# EAGLE schematic MainBoard (EAGLE 9.1.3)
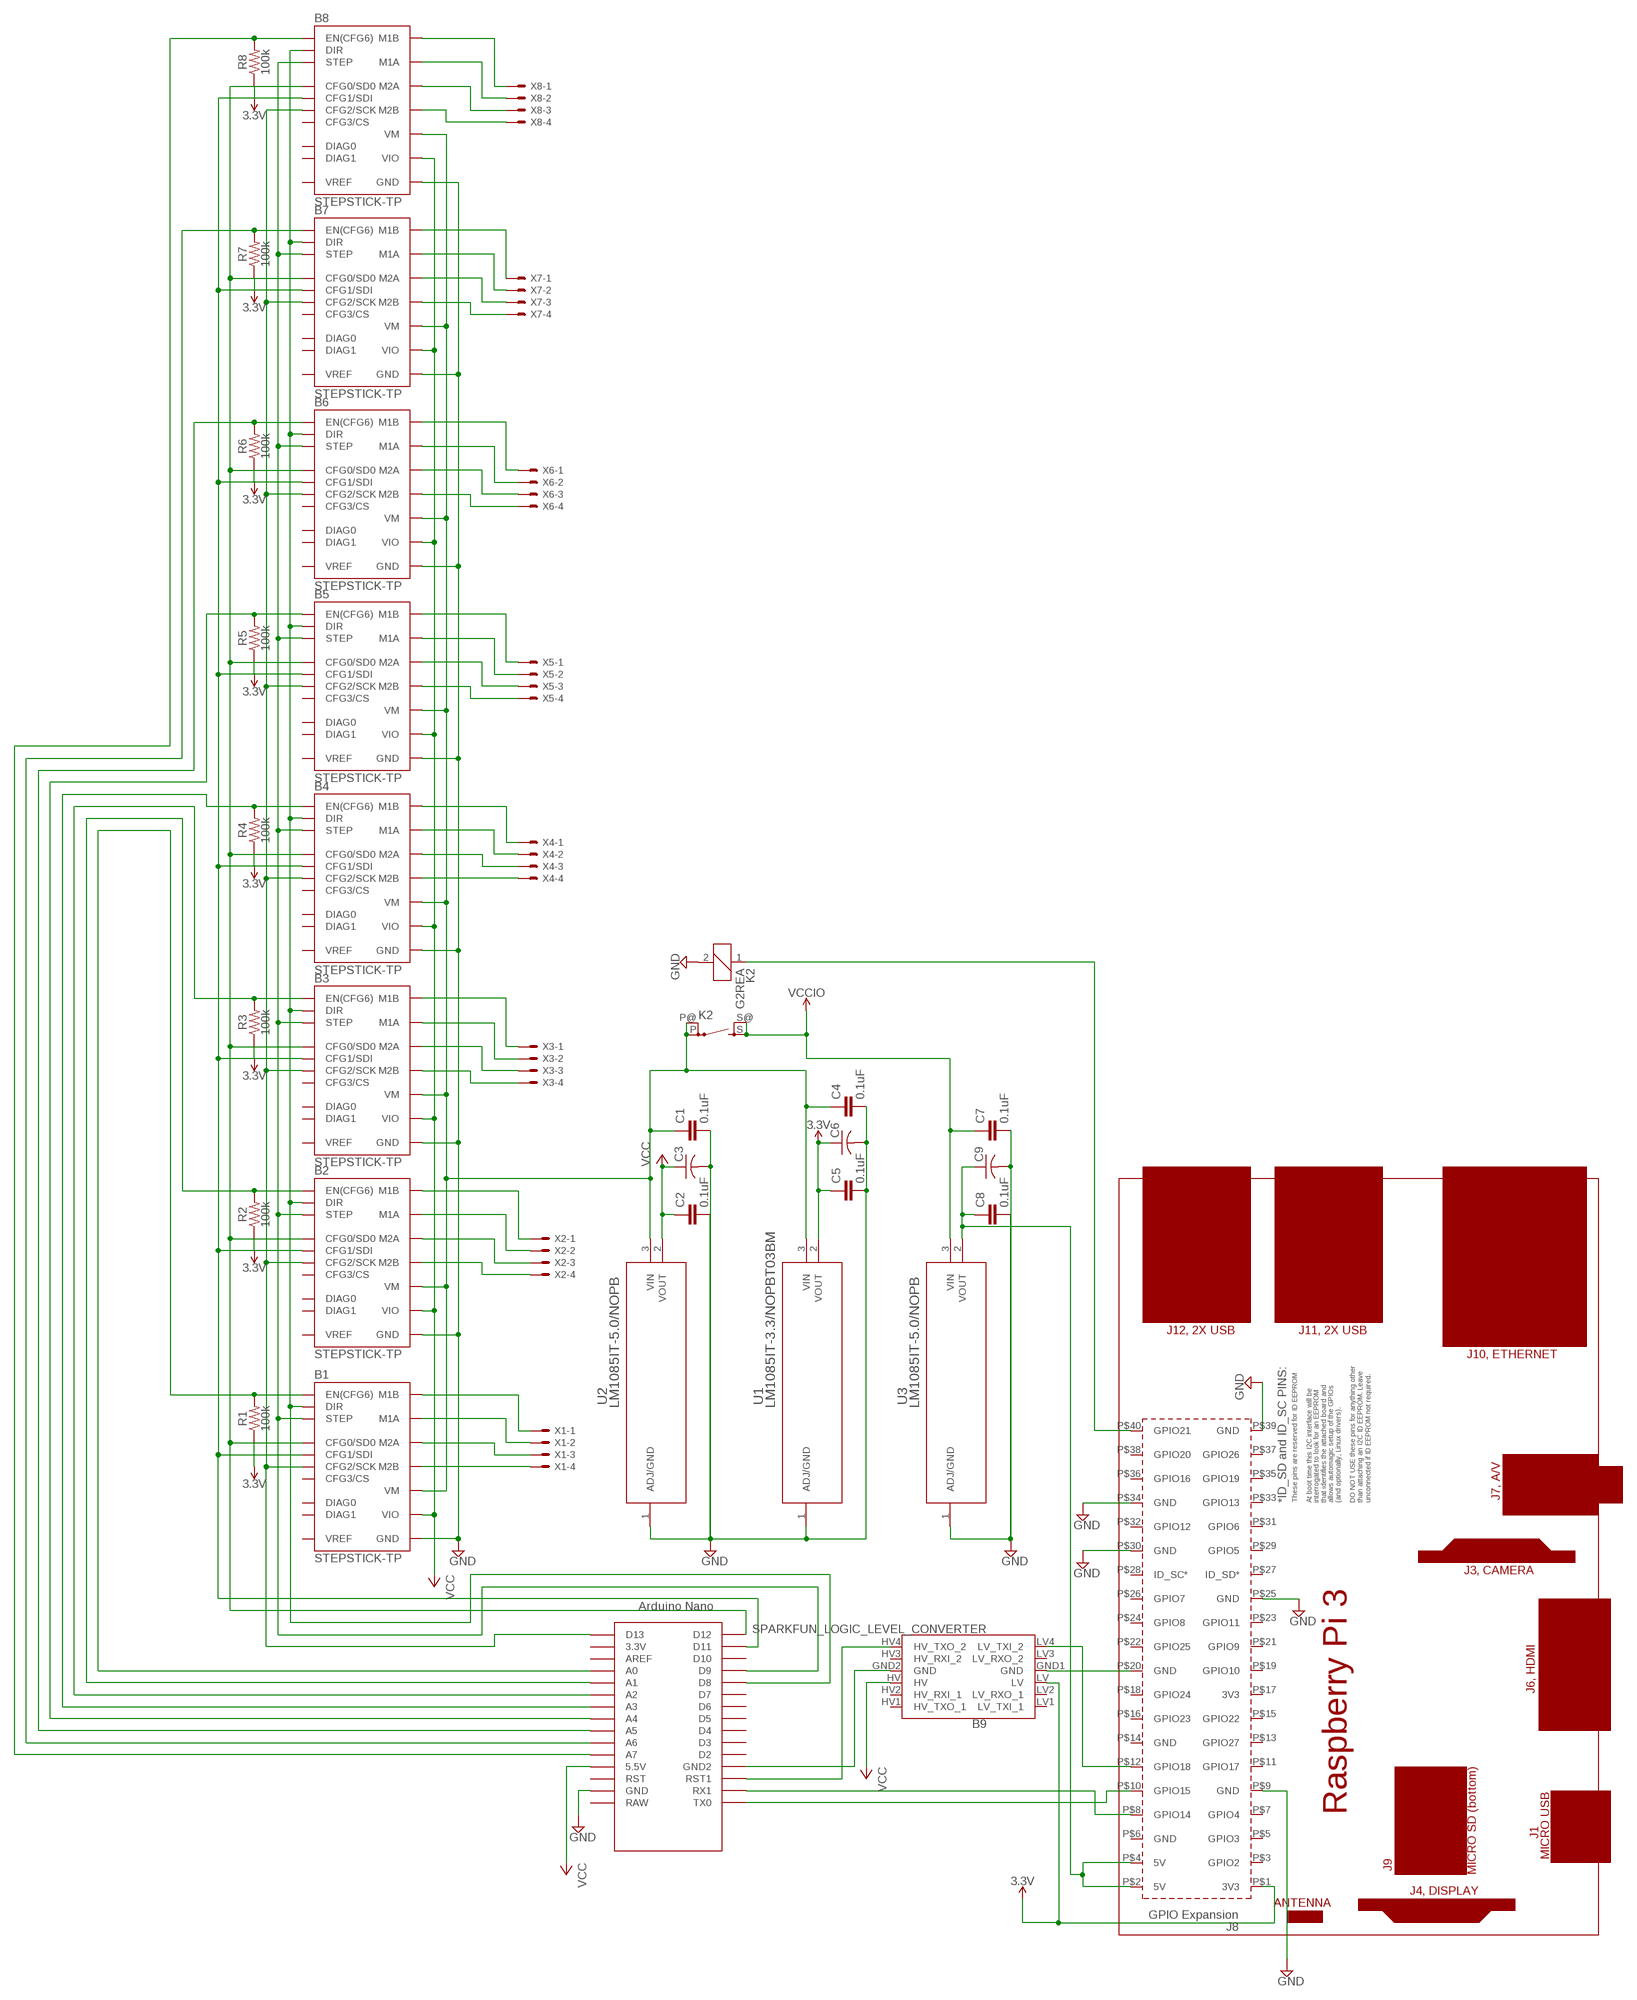
[diagram p0: schematic, sheet 1]

## Parts
B1  STEPSTICK-TP  [STEPSTICK_TP]
B2  STEPSTICK-TP  [STEPSTICK_TP]
B3  STEPSTICK-TP  [STEPSTICK_TP]
B4  STEPSTICK-TP  [STEPSTICK_TP]
B5  STEPSTICK-TP  [STEPSTICK_TP]
B6  STEPSTICK-TP  [STEPSTICK_TP]
B7  STEPSTICK-TP  [STEPSTICK_TP]
B8  STEPSTICK-TP  [STEPSTICK_TP]
B9  SPARKFUN_LOGIC_LEVEL_CONVERTER  [SPARKFUN_LOGIC_LEVEL_CONVERTER]
C1  0.1uF  0.1UF-KIT-EZ-50V-20%  [CAP-PTH-SMALL-KIT]
C2  0.1uF  0.1UF-KIT-EZ-50V-20%  [CAP-PTH-SMALL-KIT]
C3  C-US025-050X050  [C025-050X050]
C4  0.1uF  0.1UF-KIT-EZ-50V-20%  [CAP-PTH-SMALL-KIT]
C5  0.1uF  0.1UF-KIT-EZ-50V-20%  [CAP-PTH-SMALL-KIT]
C6  C-US025-050X050  [C025-050X050]
C7  0.1uF  0.1UF-KIT-EZ-50V-20%  [CAP-PTH-SMALL-KIT]
C8  0.1uF  0.1UF-KIT-EZ-50V-20%  [CAP-PTH-SMALL-KIT]
C9  C-US025-050X050  [C025-050X050]
K2  G2REA  [G2REA]
PCB1  RPI3  [RPI3]
R1  100k  100KOHM-HORIZ_KIT-1/4W-5%  [AXIAL-0.3-KIT]
R2  100k  100KOHM-HORIZ_KIT-1/4W-5%  [AXIAL-0.3-KIT]
R3  100k  100KOHM-HORIZ_KIT-1/4W-5%  [AXIAL-0.3-KIT]
R4  100k  100KOHM-HORIZ_KIT-1/4W-5%  [AXIAL-0.3-KIT]
R5  100k  100KOHM-HORIZ_KIT-1/4W-5%  [AXIAL-0.3-KIT]
R6  100k  100KOHM-HORIZ_KIT-1/4W-5%  [AXIAL-0.3-KIT]
R7  100k  100KOHM-HORIZ_KIT-1/4W-5%  [AXIAL-0.3-KIT]
R8  100k  100KOHM-HORIZ_KIT-1/4W-5%  [AXIAL-0.3-KIT]
U1  LM1085IT-3.3/NOPBT03BM  [T03BM]
U2  LM1085IT-5.0/NOPB  [T03B]
U3  LM1085IT-5.0/NOPB  [T03B]
U$1  NANO  [NANO]
X1  KK-156-4  [KK-156-4]
X2  KK-156-4  [KK-156-4]
X3  KK-156-4  [KK-156-4]
X4  KK-156-4  [KK-156-4]
X5  KK-156-4  [KK-156-4]
X6  KK-156-4  [KK-156-4]
X7  KK-156-4  [KK-156-4]
X8  KK-156-4  [KK-156-4]

## Nets
3.3V: B9.LV C5.1 C6.1 PCB1.P$1(3V3) R1.P$1 R2.P$1 R3.P$1 R4.P$1 R5.P$1 R6.P$1 R7.P$1 R8.P$1 U1.2(VOUT)
GND: B1.GND@1(GND) B1.GND@2(GND) B2.GND@1(GND) B2.GND@2(GND) B3.GND@1(GND) B3.GND@2(GND) B4.GND@1(GND) B4.GND@2(GND) B5.GND@1(GND) B5.GND@2(GND) B6.GND@1(GND) B6.GND@2(GND) B7.GND@1(GND) B7.GND@2(GND) B8.GND@1(GND) B8.GND@2(GND) C1.2 C2.2 C3.2 C4.2 C5.2 C6.2 C7.2 C8.2 C9.2 K2.2 PCB1.P$9(GND) PCB1.P$25(GND) PCB1.P$30(GND) PCB1.P$34(GND) PCB1.P$39(GND) U1.1(ADJ/GND) U2.1(ADJ/GND) U3.1(ADJ/GND) U$1.GND
N$1: B9.HV4(HV_TXO_2) U$1.RST1
N$2: B1.CFG2(CFG2/SCK) B2.CFG2(CFG2/SCK) B3.CFG2(CFG2/SCK) B4.CFG2(CFG2/SCK) B5.CFG2(CFG2/SCK) B6.CFG2(CFG2/SCK) B7.CFG2(CFG2/SCK) B8.CFG2(CFG2/SCK) U$1.D13
N$3: B5.EN(EN(CFG6)) R5.P$2 U$1.A4
N$4: B6.EN(EN(CFG6)) R6.P$2 U$1.A5
N$5: B8.M1B X8.1
N$6: B8.M1A X8.2
N$7: B8.M2A X8.3
N$8: B8.M2B X8.4
N$9: B7.M1B X7.1
N$10: B7.M1A X7.2
N$11: B7.M2A X7.3
N$12: B7.M2B X7.4
N$13: B6.M1B X6.1
N$14: B6.M1A X6.2
N$15: B6.M2A X6.3
N$16: B6.M2B X6.4
N$17: B5.M1B X5.1
N$18: B5.M1A X5.2
N$19: B5.M2A X5.3
N$20: B5.M2B X5.4
N$21: B4.M1B X4.1
N$22: B4.M1A X4.2
N$23: B4.M2A X4.3
N$24: B4.M2B X4.4
N$25: B3.M1B X3.1
N$26: B3.M1A X3.2
N$27: B3.M2A X3.3
N$28: B3.M2B X3.4
N$29: B2.M1B X2.1
N$30: B2.M1A X2.2
N$31: B2.M2A X2.3
N$32: B2.M2B X2.4
N$33: B1.M1B X1.1
N$34: B1.M1A X1.2
N$35: B1.M2A X1.3
N$36: B1.M2B X1.4
N$37: B9.GND2(GND) U$1.GND1(GND2)
N$38: B7.EN(EN(CFG6)) R7.P$2 U$1.A6
N$39: C8.1 C9.1 PCB1.P$2(5V) PCB1.P$4(5V) U3.2(VOUT)
N$40: B8.EN(EN(CFG6)) R8.P$2 U$1.A7
N$41: B4.EN(EN(CFG6)) R4.P$2 U$1.A3
N$42: B3.EN(EN(CFG6)) R3.P$2 U$1.A2
N$43: B2.EN(EN(CFG6)) R2.P$2 U$1.A1
N$44: B1.EN(EN(CFG6)) R1.P$2 U$1.A0
N$45: B1.NC/CFG0(CFG0/SD0) B2.NC/CFG0(CFG0/SD0) B3.NC/CFG0(CFG0/SD0) B4.NC/CFG0(CFG0/SD0) B5.NC/CFG0(CFG0/SD0) B6.NC/CFG0(CFG0/SD0) B7.NC/CFG0(CFG0/SD0) B8.NC/CFG0(CFG0/SD0) U$1.D12
N$46: B1.CFG1(CFG1/SDI) B2.CFG1(CFG1/SDI) B3.CFG1(CFG1/SDI) B4.CFG1(CFG1/SDI) B5.CFG1(CFG1/SDI) B6.CFG1(CFG1/SDI) B7.CFG1(CFG1/SDI) B8.CFG1(CFG1/SDI) U$1.D11
N$49: B1.DIR B2.DIR B3.DIR B4.DIR B5.DIR B6.DIR B7.DIR B8.DIR U$1.D8
N$50: B1.STEP B2.STEP B3.STEP B4.STEP B5.STEP B6.STEP B7.STEP B8.STEP U$1.D9
N$51: PCB1.P$8(GPIO14) U$1.RX1
N$52: PCB1.P$10(GPIO15) U$1.TX0
N$53: B9.GND1(GND) PCB1.P$20(GND)
N$54: B9.LV4(LV_TXI_2) PCB1.P$12(GPIO18)
N$61: B1.VM B2.VM B3.VM B4.VM B5.VM B6.VM B7.VM B8.VM C1.1 C4.1 K2.P(2:P) K2.P@(2:P) U1.3(VIN) U2.3(VIN)
N$62: K2.1 PCB1.P$40(GPIO21)
VCC: B1.VIO B2.VIO B3.VIO B4.VIO B5.VIO B6.VIO B7.VIO B8.VIO B9.HV C2.1 C3.1 U2.2(VOUT) U$1.5V(5.5V)
VCCIO: C7.1 K2.S(2:S) K2.S@(2:S) U3.3(VIN)
Unconnected: B1.CFG3(CFG3/CS) B1.DIAG0 B1.DIAG1 B1.VREF B2.CFG3(CFG3/CS) B2.DIAG0 B2.DIAG1 B2.VREF B3.CFG3(CFG3/CS) B3.DIAG0 B3.DIAG1 B3.VREF B4.CFG3(CFG3/CS) B4.DIAG0 B4.DIAG1 B4.VREF B5.CFG3(CFG3/CS) B5.DIAG0 B5.DIAG1 B5.VREF B6.CFG3(CFG3/CS) B6.DIAG0 B6.DIAG1 B6.VREF B7.CFG3(CFG3/CS) B7.DIAG0 B7.DIAG1 B7.VREF B8.CFG3(CFG3/CS) B8.DIAG0 B8.DIAG1 B8.VREF B9.HV1(HV_TXO_1) B9.HV2(HV_RXI_1) B9.HV3(HV_RXI_2) B9.LV1(LV_TXI_1) B9.LV2(LV_RXO_1) B9.LV3(LV_RXO_2) PCB1.P$3(GPIO2) PCB1.P$5(GPIO3) PCB1.P$6(GND) PCB1.P$7(GPIO4) PCB1.P$11(GPIO17) PCB1.P$13(GPIO27) PCB1.P$14(GND) PCB1.P$15(GPIO22) PCB1.P$16(GPIO23) PCB1.P$17(3V3) PCB1.P$18(GPIO24) PCB1.P$19(GPIO10) PCB1.P$21(GPIO9) PCB1.P$22(GPIO25) PCB1.P$23(GPIO11) PCB1.P$24(GPIO8) PCB1.P$26(GPIO7) PCB1.P$27(ID_SD*) PCB1.P$28(ID_SC*) PCB1.P$29(GPIO5) PCB1.P$31(GPIO6) PCB1.P$32(GPIO12) PCB1.P$33(GPIO13) PCB1.P$35(GPIO19) PCB1.P$36(GPIO16) PCB1.P$37(GPIO26) PCB1.P$38(GPIO20) U$1.3.3V U$1.AREF U$1.D2 U$1.D3 U$1.D4 U$1.D5 U$1.D6 U$1.D7 U$1.D10 U$1.ICSP1 U$1.ICSP2 U$1.ICSP3 U$1.ICSP4 U$1.ICSP5 U$1.ICSP6 U$1.RAW U$1.RST

## Library data of the parts
B1-B8 = we-board:STEPSTICK: SilentStepStick - Trinamic TMC2100/TMC2130 Stepper Motor Driver TMC2100 - CFG pins for configuration TMC2130 - SPI for configuration Pin CFG0/SDO only available on TMC2130 SilentStepStick.
B9 = SparkFun-Boards:SPARKFUN_LOGIC_LEVEL_CONVERTER: SparkFun Logic Level Converter -Bi-Directional This is the mechnical outline for the 3.3V - 5V bi directional logic level converter. *Note, the "LOCK" Package has the header pins staggered by an offset of 5 mils (off center line), so that when you slide a row of standard 0.1" headers into the PTH pads, it will hold position vertically. See the follwing turorial for more information on this type of special footprints: Sneaky Footprints <https://www.sparkfun.com/tutorials/114> SparkFun Products: SparkFun Logic Level Converter - Bi-Directional <https://www.sparkfun.com/products/12009>
C1 C2 C4 C5 C7 C8 = SparkFun-Capacitors:0.1UF: 0.1µF ceramic capacitors A capacitor is a passive two-terminal electrical component used to store electrical energy temporarily in an electric field.; PROD_ID: CAP-08370
C3 C6 C9 = rcl:C-US: CAPACITOR, American symbol; SPICEPREFIX: C
K2 = relay:G2REA: RELAY 1 x norm. open, high current, Omron; OC_FARNELL: unknown; OC_NEWARK: unknown
PCB1 = e14_Rpi3_RevA:RPI3: Device for Raspberry Pi 3 board created by Dave Young for www.element14.com More information and support community is available at https://www.element14.com/community/community/raspberry-pi
R1-R8 = SparkFun-Resistors:100KOHM: 100kΩ resistor A resistor is a passive two-terminal electrical component that implements electrical resistance as a circuit element. Resistors act to reduce current flow, and, at the same time, act to lower voltage levels within circuits. - Wikipedia; PROD_ID: RES-10686
U1 = LM1085it-3.3:LM1085IT-3.3/NOPB; MANUFACTURER_PART_NUMBER: LM1085IT3.3NOPB; VENDOR: Texas Instruments
U2 U3 = LM1085:LM1085IT-5.0/NOPB; MANUFACTURER_PART_NUMBER: LM1085IT5.0NOPB; VENDOR: Texas Instruments
U$1 = Arduino-clone:NANO: Arduino Nano
X1-X8 = con-molex:KK-156-4: KK 156 HEADER Source: http://www.molex.com/pdm_docs/sd/026604100_sd.pdf; MF: MOLEX; OC_FARNELL: unknown; OC_NEWARK: unknown